# EAGLE design lab05 (EAGLE 9.6.0)
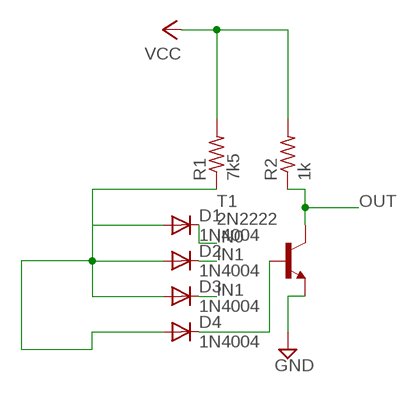
[diagram p0: schematic, sheet 1]

## Parts
D1  1N4004  [DO41-10]
D2  1N4004  [DO41-10]
D3  1N4004  [DO41-10]
D4  1N4004  [DO41-10]
R1  7k5  R-US_0204/5  [0204/5]
R2  1k  R-US_0204/5  [0204/5]
T1  2N2222  [TO92-EBC-OVAL]

## Nets
GND: T1.E
IN0: D1.C
IN1: D2.C
N$1: D1.A D2.A D3.A D4.A R1.1
N$2: D4.C T1.B
N$5: D3.C
OUT: R2.1 T1.C
VCC: R1.2 R2.2

## Library data of the parts
D1-D4 = adafruit:1N4004: DIODE General purpose 1N400x type rectifier (With bigger pads) http://www.ladyada.net/library/pcb/eaglelibrary.html
R1 R2 = adafruit:R-US_: RESISTOR, American symbol
T1 = adafruit:2N2222: NPN TRANSISTOR Big oval pads

## Board
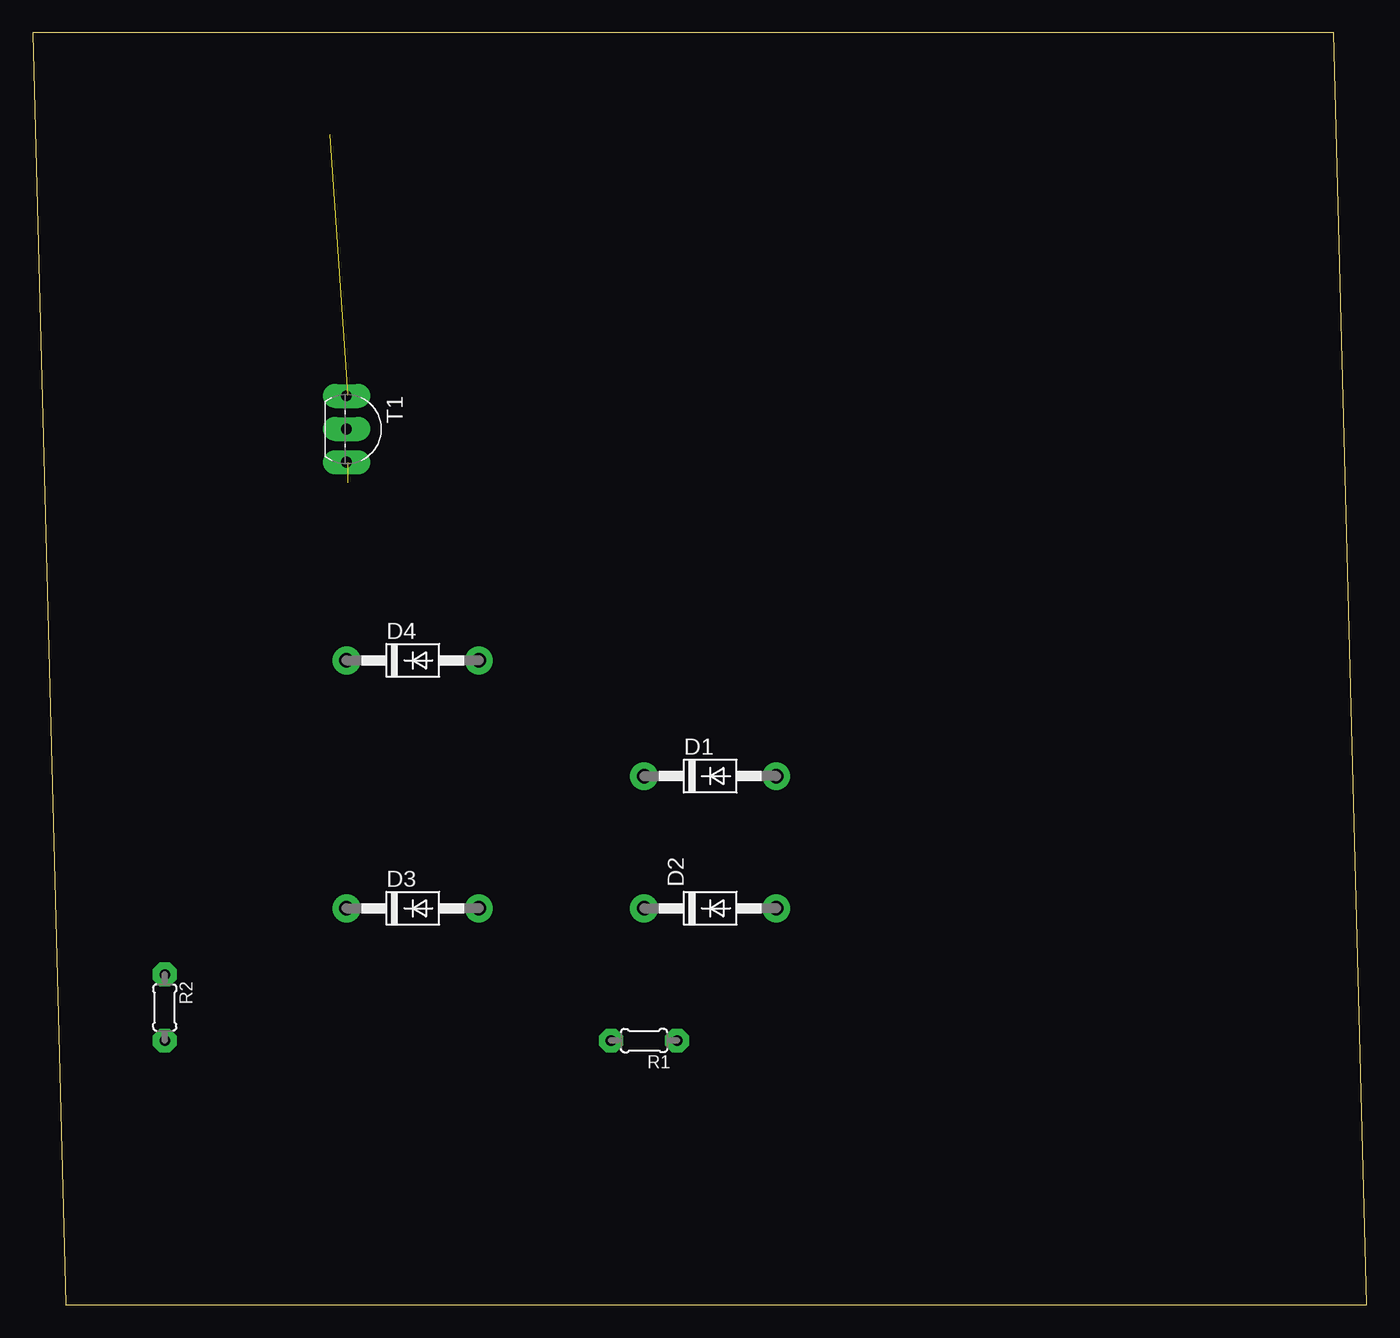
[diagram p1: board, top side]
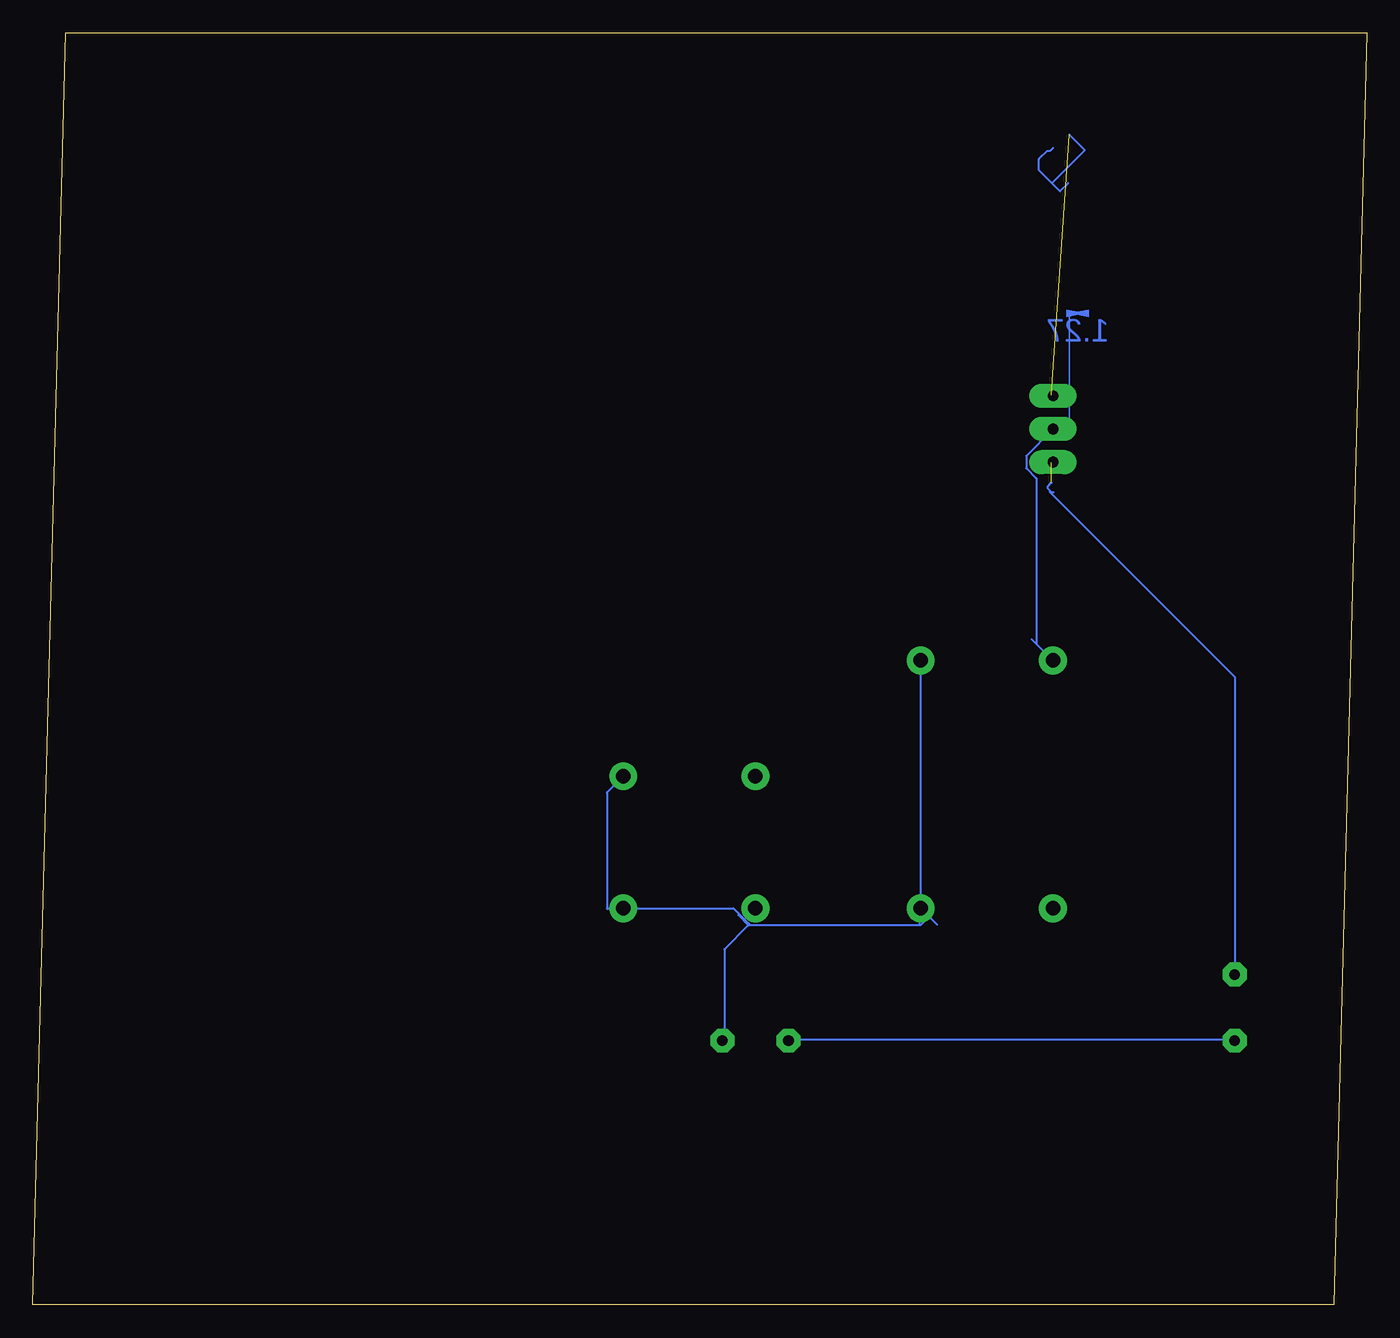
[diagram p2: board, bottom side, seen from below]

Size 102.54 x 97.78 mm. Coordinates in mm from the lower left corner, seen from the top.
Outline: 2.54,0 102.54,0 100,97.78 0,97.78 2.54,0
Copper layers (1*16): Top 0.035mm / dielectric 1.5mm / Bottom 0.035mm
Design rules "default *": minimum track width 6mil, minimum drill 10mm, track to track 10mil, track to pad 6mil, pad to pad 6mil, via to via 6mil, smd to smd 6mil, copper to edge 40mil, drill to drill 6mil, minimum pad ring 10mil, minimum via ring 8mil, stop-mask expansion 4mil, vias tented up to drill 0mil, thermal gap 10mil

### Footprints (pad centres in the part's own frame; a part is rotated, then mirrored left to right if it is on the bottom)
DO41-10 = drill 1.118 pad 1.93: A 5.08,0; C -5.08,0
0204/5 = drill 0.813 pad 1.676 octagon: 1 -2.54,0; 2 2.54,0
TO92-EBC-OVAL = drill 0.813 long: B 0,-1.27; C 2.54,-1.27; E -2.54,-1.27

### Placement (x,y rotation side)
D1  52.07,40.64 0 top
D2  52.07,30.48 0 top
D3  29.21,30.48 0 top
D4  29.21,49.53 0 top
R1  46.99,20.32 180 top
R2  10.16,22.86 270 top
T1  25.4,67.31 270 top

### Tracks (layer width: path | path; a pad name or v marks a point on that pad's centre or on a via)
GND  (1 unrouted)
  Bottom 0.152: 22.86,89.93 21.68,88.75 24.22,86.22 | 24.22,86.22 23.59,85.58 22.96,86.21 | 24.22,86.22 25.2,87.19 25.2,88.07 24.57,88.7 24.33,88.7 24.13,88.9 | T1.E 24.18,69.9 24.23,69.9
N$1
  Bottom 0.152: D1.A 58.37,39.42 | 58.37,39.42 58.42,39.37 | 58.42,30.48 58.37,30.48 | 58.37,30.48 D2.A 48.68,30.48 48.32,30.12 | 48.32,30.12 47.48,29.29 | 34.37,29.29 34.29,29.21 | D3.A 33.02,29.21 | 34.29,29.21 33.68,29.82 D3.A | 47.55,29.21 34.29,29.21 | 47.55,29.21 48.31,29.97 48.31,30.12 48.32,30.12 | 58.37,30.48 58.37,39.42 | 58.37,30.43 58.37,30.48 | D3.A D4.A | R1.1 49.38,20.42 49.38,27.33 47.55,29.16 47.55,29.21
N$2
  Bottom 0.152: 24.38,66.55 24.08,66.55 24.04,66.59 24.13,66.69 T1.B 26.19,65.25 26.19,64.3 25.4,63.51 25.4,50.8 | 25.76,51.16 25.4,50.8 | 25.4,50.8 D4.C
OUT  (1 unrouted)
  Bottom 0.152: 24.23,63.2 24.54,62.89 24.54,62.74 24.33,62.54 | 24.33,62.54 24.23,62.43 24.08,62.43 | 24.23,64.72 T1.C | R2.1 10.16,48.26 24.38,62.48 24.33,62.54
VCC
  Bottom 0.152: R2.2 10.16,20.42 44.3,20.42 R1.2
(copper drawn outside any net)
  shapes: Bottom area x1